# Altium schematic sheet bqZUM_Power.SchDoc: Power
size A4; Date: 20140218; Author: Raúl de Pablos; CompanyName: bq - Mundo Reader; Organization: bq - Mundo Reader; DocumentNumber: 7; Revision: 2.6; SheetNumber: 7; SheetTotal: 8; ProjectName: ZUM BT328
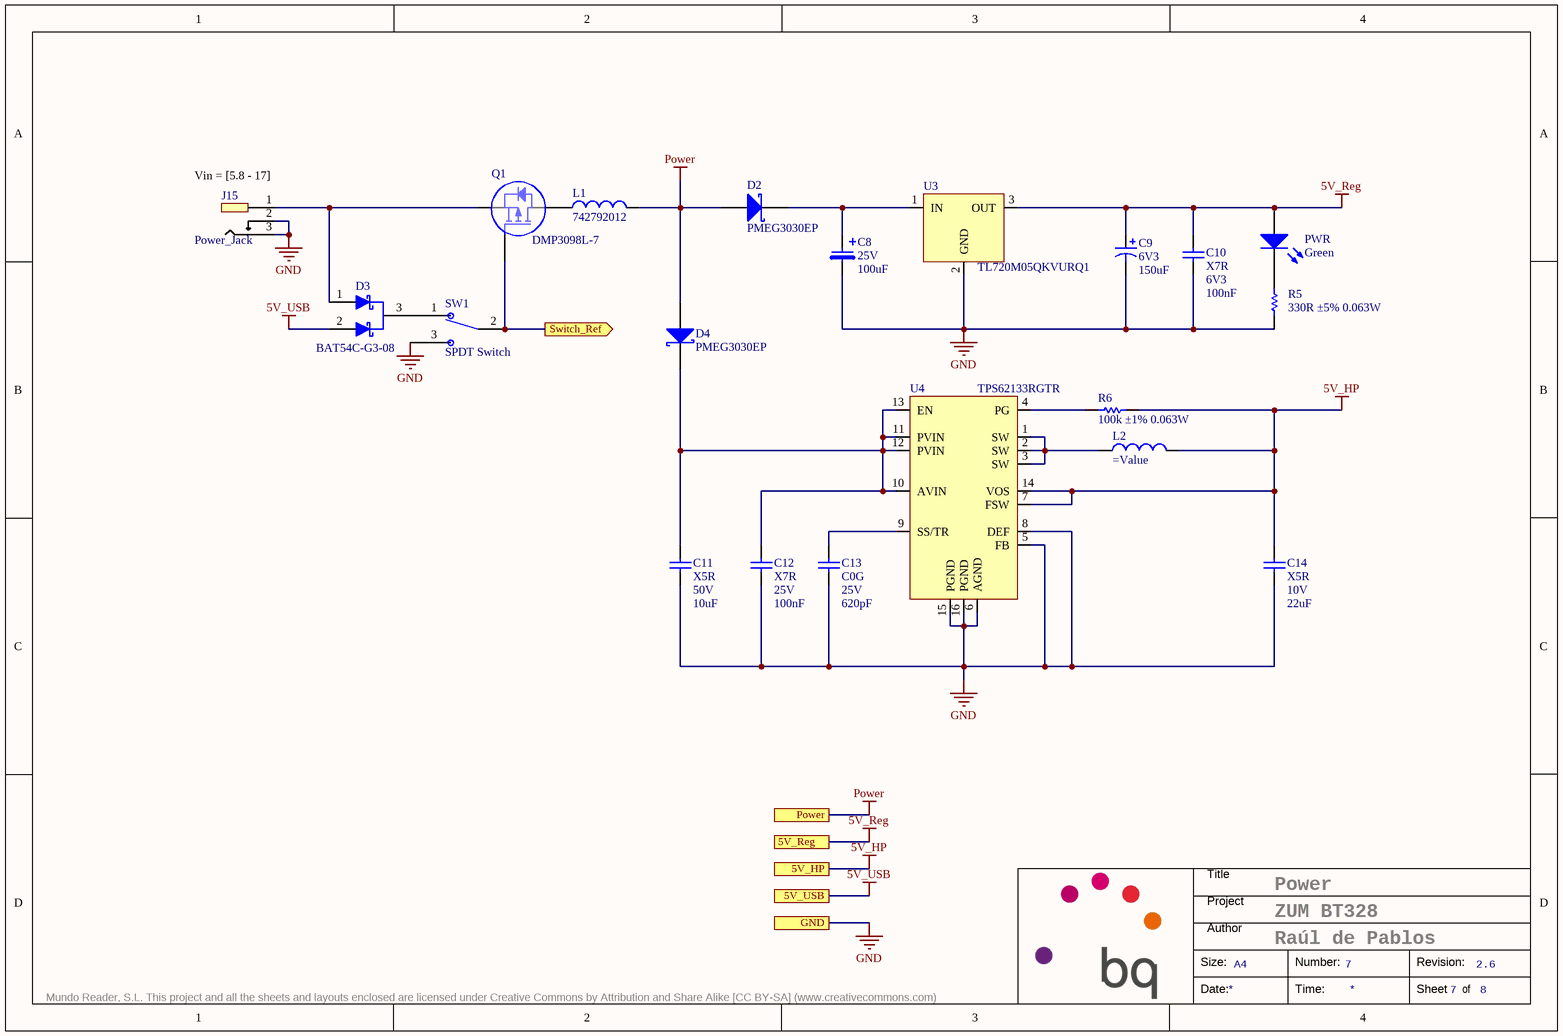
[diagram p0: bqZUM_Power.SchDoc]

## Parts
C8  Voltage: 25V  Capacitance: 100uF  [CASE_D_7.7]  (hidden comment: Electrolytic)
C9  Voltage: 6V3  Capacitance: 150uF  [CASE_B_3528-1411]  (hidden comment: Tantalum)
C10  Dielectric: X7R  Voltage: 6V3  Capacitance: 100nF  [C0402]  (hidden comment: Capacitor)
C11  Dielectric: X5R  Voltage: 50V  Capacitance: 10uF  [C1206]  (hidden comment: Capacitor)
C12  Dielectric: X7R  Voltage: 25V  Capacitance: 100nF  [C0603]  (hidden comment: Capacitor)
C13  Dielectric: C0G  Voltage: 25V  Capacitance: 620pF  [C0603]  (hidden comment: Capacitor)
C14  Dielectric: X5R  Voltage: 10V  Capacitance: 22uF  [C1206]  (hidden comment: Capacitor)
D2  PMEG3030EP  [SOD128]
D3  BAT54C-G3-08  [SOT23-3]
D4  PMEG3030EP  [SOD128]
J15  Power_Jack  [Jack 2.1]
L1  742792012  [L0805]
L2  (no value)  [SRN8040]
PWR  Green  [LED0603]
Q1  DMP3098L-7  [SOT23-3]
R5  value 330R ±5% 0.063W  [R0402]  (hidden comment: Resistor)
R6  value 100k ±1% 0.063W  [R0402]  (hidden comment: Resistor)
SW1  SPDT Switch  [Slide SW SPDT Right Angle]
U3  TL720M05QKVURQ1  [TO-252]
U4  TPS62133RGTR  [QFN16]

## Ports
5V_HP, 5V_Reg, 5V_USB, GND, Power, Switch_Ref (out)

## Nets
5V_HP: C14.2 L2.2 R6.2 U4.7(FSW) U4.14(VOS) ; port 5V_HP
5V_Reg: C9.1 C10.2 PWR.A U3.3(OUT) ; port 5V_Reg
5V_USB: D3.2(A2) ; port 5V_USB
GND: C8.2 C9.2 C10.1 C11.1 C12.1 C13.1 C14.1 J15.2 J15.3 R5.1 SW1.3 U3.2(GND) U4.5(FB) U4.6(AGND) U4.8(DEF) U4.15(PGND) U4.16(PGND) ; port GND
Power: D2.A D4.A L1.2 ; port Power
Switch_Ref: Q1.1(G) SW1.2 ; port Switch_Ref
NetC8_1: C8.1 D2.k(K) U3.1(IN)
NetC11_2: C11.2 C12.2 D4.k(K) U4.10(AVIN) U4.11(PVIN) U4.12(PVIN) U4.13(EN)
NetC13_2: C13.2 U4.9(SS/TR)
NetD3_1: D3.1(A1) J15.1 Q1.2(S)
NetD3_3: D3.3(K) SW1.1
NetL1_1: L1.1 Q1.3(D)
NetL2_1: L2.1 U4.1(SW) U4.2(SW) U4.3(SW)
NetPWR_K: PWR.K R5.2
NetR6_1: R6.1 U4.4(PG)

## Notes on the sheet
- (near J15) Vin = [5.8 - 17]
- Title
- Project
- Size:
- Author
- A4
- Number:
- Revision:
- Mundo Reader, S.L. This project and all the sheets and layouts enclosed are licensed under Creative Commons by Attribution and Share Alike [CC BY-SA] (www.creativecommons.com)
- Date:
- Time:
- Sheet
- of

## Library data of the parts
C8 = Cap_Al_100uF_25V: Capacitor Electrolytic; Manufacturer: Panasonic; Value: 100uF 25V; OrderingCode: EEE-HA1E101XP; Temp_ Max: 85; Temp_ Min: -40; Part Number: Cap_Al_100uF_25V
C9 = 150uF_6V3_±20%: Tantalum Capacitor; Manufacturer: Vishay; Value: 150uF ±20% 6V3; Tolerance: ±20%; ESR: 40m; OrderingCode: T55B157M6R3C0040; Temp_ Max: 105; Temp_ Min: -55; Part Number: 150uF_6V3_±20%
C10 = C0402_100nF_6V3_±10%: Manufacturer: Kemet; Value: 100nF ±10% 6V3; Tolerance: ±10%; OrderingCode: C0402C104K9RAC; Temp_ Max: 125; Temp_ Min: -55; Part Number: C0402_100nF_6V3_±10%
C11 = C1206_10uF_50V_±20%: Manufacturer: Taiyo Yuden; Value: 10uF ±20% 50V; Tolerance: ±20%; OrderingCode: UMK316BBJ106ML-T; Temp_ Max: 125; Temp_ Min: -55; Part Number: C1206_10uF_50V_±20%
C12 = C0603_100nF_25V_±10%: Manufacturer: Kemet; Value: 100nF ±10% 25V; Tolerance: ±10%; OrderingCode: C0603C104K3RAC; Temp_ Max: 125; Temp_ Min: -55; Part Number: C0603_100nF_25V_±10%
C13 = C0603_620pF_25V_±5%: Manufacturer: Murata; Value: 620pF ±5% 25V; Tolerance: ±5%; OrderingCode: GRM1885C1E621JA01D; Temp_ Max: 125; Temp_ Min: -55; Part Number: C0603_620pF_25V_±5%
C14 = C1206_22uF_10V_±20%: Manufacturer: Taiyo Yuden; Value: 22uF ±20% 10V; Tolerance: ±20%; OrderingCode: LMK316ABJ226ML-T; Temp_ Max: 85; Temp_ Min: -55; Part Number: C1206_22uF_10V_±20%
D2 D4 = PMEG3030EP: Diodo Schottky; Manufacturer: NXP; Ifor: 3A; Vrrm: 30V; Ifsm: 50A; Vf: 0,36V; Temp_ Max: 150; Temp_ Min: -55; Value: 3A 30V; Part Number: PMEG3030EP; OrderingCode: PMEG3030EP
D3 = BAT54C: Dual Schottky Diode Common Cathode; Part Number: BAT54C; Manufacturer: Vishay; Ifor: 200mA; Vrrm: 30V; Ifsm: 600mA; Vf: 0,8V; Temp_ Max: 125; Temp_ Min: -55; Value: 200mA 30V; OrderingCode: BAT54C-G3-08; Manufacturer 2: Fairchild; OrderingCode 2: BAT54C
J15 = DC Power Jack: Manufacturer: Kycon; Idc: 5A; OrderingCode: KLDHCX0202A; OrderingCode 2: RAPC722X; Part Number: DC Power Jack; Manufacturer 2: Switchcraft
L1 = L0805_33R_0,008R_4000mA: Ferrite Bead; Manufacturer: Würth Elektronik; Resistance_100MHz: 33R; Resistance_DC: 0,008R; Current: 4000mA; Temp_ Max: 125; Temp_ Min: -55; Value: 33R 0,008R 4000mA; Part Number: L0805_33R_0,008R_4000mA; OrderingCode: 742792012
L2 = 2,2uH_6,3A: Inductor SMD; Manufacturer: Bourns; L: 2,2uH; Rdc: 0,013R; Current: 6,3A; Current Sat#: 7,3A; OrderingCode: SRN8040-2R2Y; Temp_ Max: 105; Temp_ Min: -40; Value: 2,2uH 6,3A; Part Number: 2,2uH_6,3A
PWR = LG Q971-KN-1: Light Emitting Diode; Manufacturer: OSRAM Opto; Temp_ Max: 85; Temp_ Min: -40; OrderingCode 2: HSMG-C190; Part Number: LG Q971-KN-1; OrderingCode: LG Q971-KN-1; Manufacturer 2: Avago Technologies; Value: Green
Q1 = DMP3098L: Mosfet Channel P Enhancement Mode; Manufacturer: Diodes Incorporated; Vds: 30V; Vgss: 20V; Id: 3,8A; Temp_ Max: 150; Temp_ Min: -55; Part Number: DMP3098L; OrderingCode: DMP3098L-7
R5 = R0402_330R_0.063W_±5%: Manufacturer: Vishay; Tolerance: ±5%; OrderingCode: CRCW0402330RJN; Power: 0.063W; Resistance: 330R; Temp_ Max: 155; Temp_ Min: -55; PackageDescription: SMD; Part Number: R0402_330R_0.063W_±5%
R6 = R0402_100k_0.063W_±1%: Manufacturer: Vishay; Tolerance: ±1%; OrderingCode: CRCW0402100KFK; Power: 0.063W; Resistance: 100k; Temp_ Max: 155; Temp_ Min: -55; PackageDescription: SMD; Part Number: R0402_100k_0.063W_±1%
SW1 = Switch SPDT: Manufacturer: Würth Elektronik; OrderingCode: 450 302 014 072; Temp_ Max: 85; Temp_ Min: -40; OrderingCode 2: MMP1010D-RA; Part Number: Switch SPDT; Manufacturer 2: Knitter-Switch
U3 = TL720M05-Q1: Standard 3pin LDO; Manufacturer: Texas Instruments; Voltage IN: 5.5÷42 VDC; Voltage OUT: 5 VDC; Current OUT: 450 mA; Temp_ Max: 125; Temp_ Min: -40; Part Number: TL720M05-Q1; OrderingCode: TL720M05QKVURQ1
U4 = TPS62133: 3A High Efficient Synchronous Step Down Converter with DCS™ Control; Manufacturer: Texas Instruments; Voltage IN: 3÷17 VDC; Voltage OUT: 0,9÷6 VDC; Temp_ Max: 85; Temp_ Min: -40; Part Number: TPS62133; Current OUT: 3A; OrderingCode: TPS62133RGTR